# EAGLE design Schematic_rfclock_frontend (EAGLE 9.6.2)
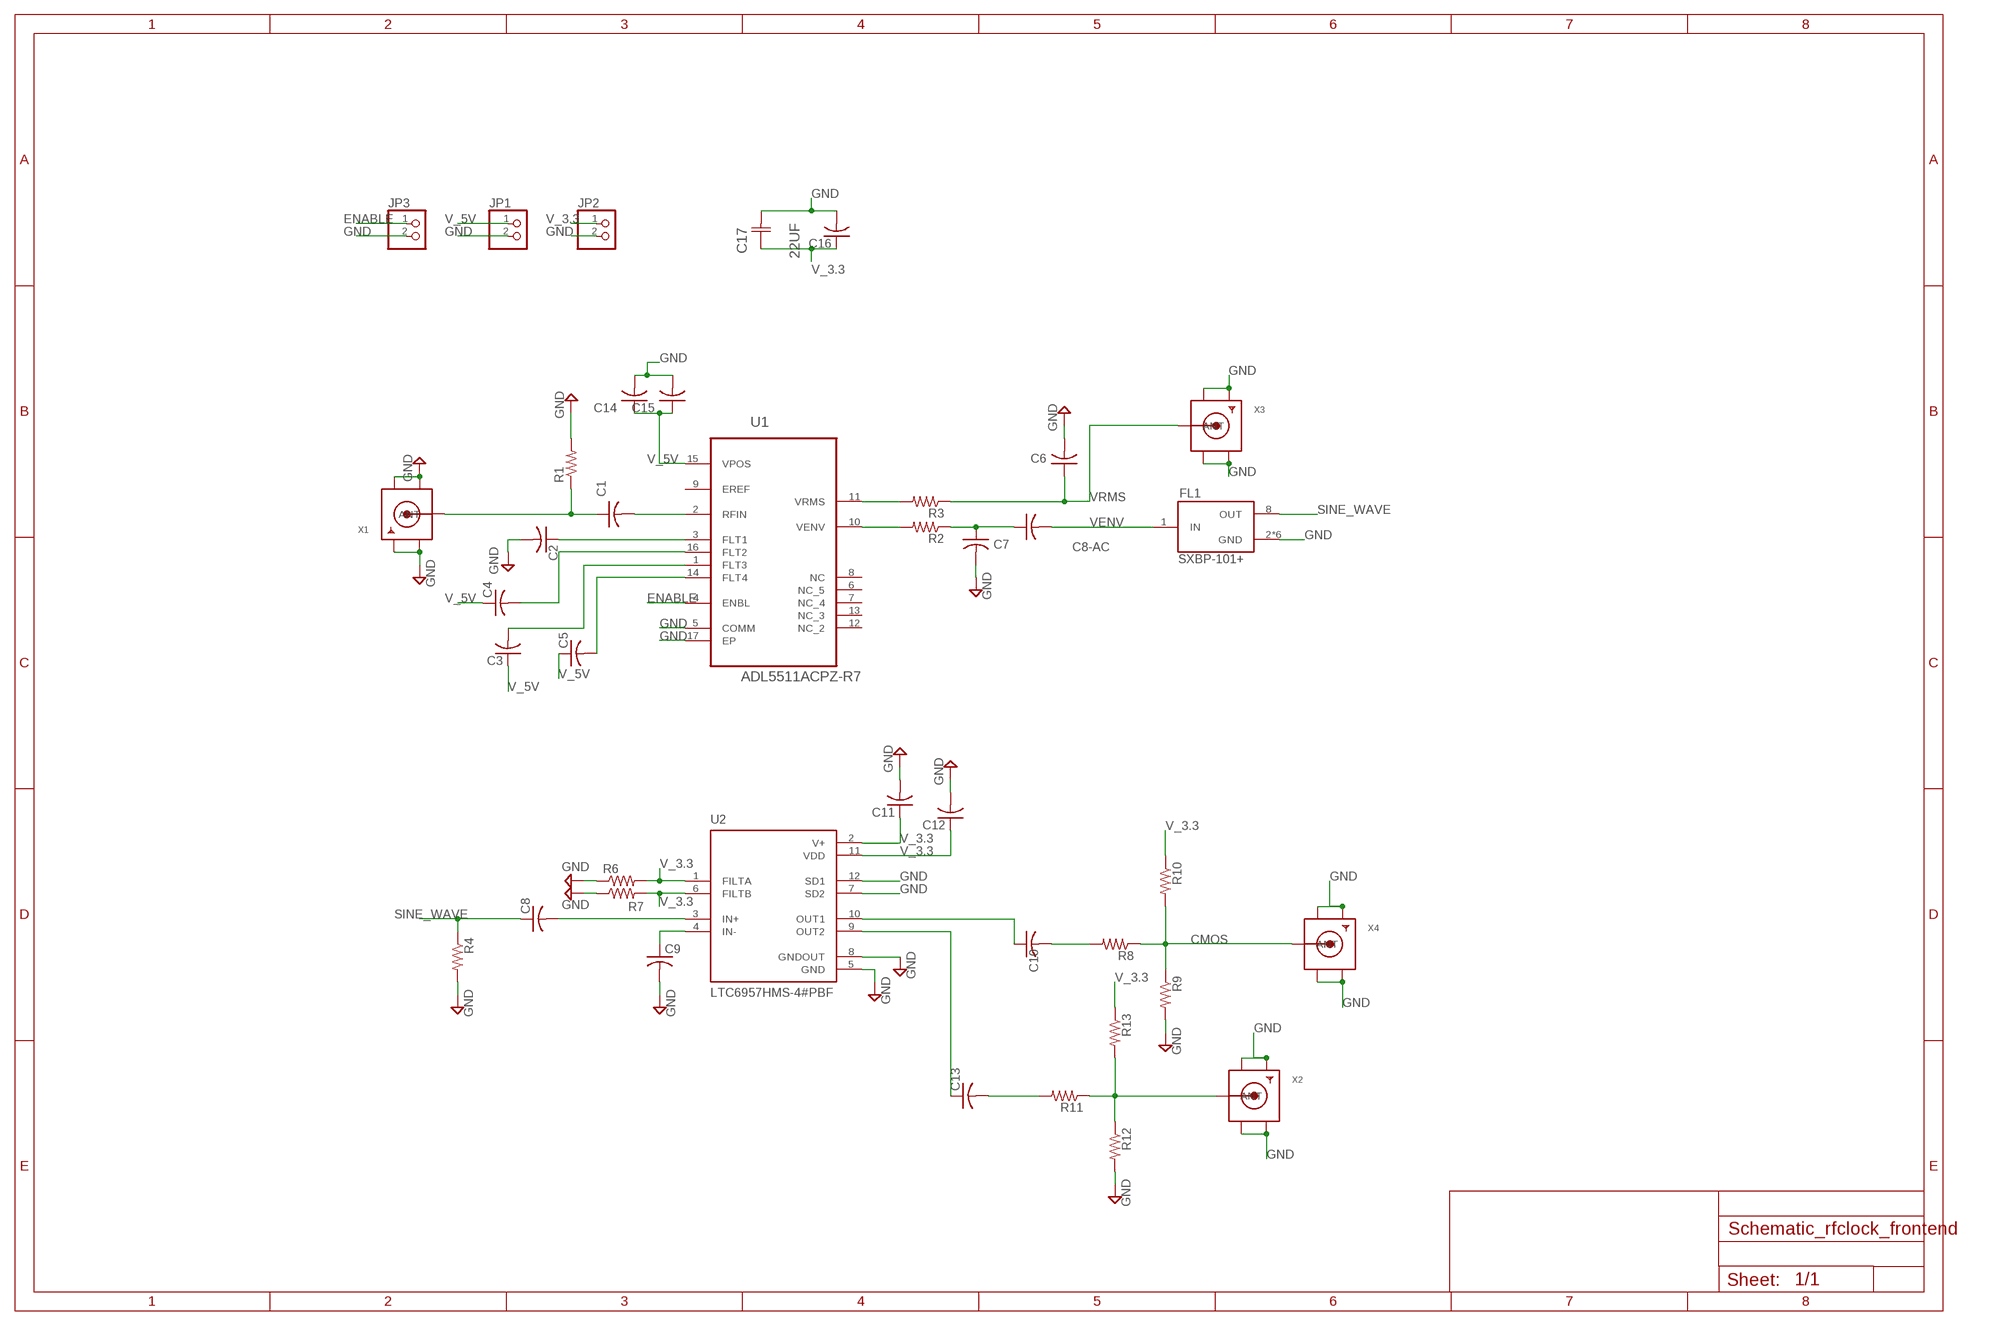
[diagram p0: schematic, sheet 1]

## Parts
C1  C-USC0402K  [C0402K]
C2  C-USC0402K  [C0402K]
C3  C-USC0402  [C0402]
C4  C-USC0402  [C0402]
C5  C-USC0402  [C0402]
C6  C-USC0402  [C0402]
C7  C-USC0402  [C0402]
C8  C-USC0603  [C0603]
C8-AC  C-USC0402K  [C0402K]
C9  C-USC0603  [C0603]
C10  C-USC0603K  [C0603K]
C11  C-USC0603K  [C0603K]
C12  C-USC0603K  [C0603K]
C13  C-USC0603K  [C0603K]
C14  C-USC0402  [C0402]
C15  C-USC0402  [C0402]
C16  C-USC0603  [C0603]
C17  22UF  TPSB226M010R0700  [CAPCP3528X210N]
FL1  SXBP-101+  [FIL_SXBP-101+]
JP1  PINHD-1X2  [1X02]
JP2  PINHD-1X2  [1X02]
JP3  PINHD-1X2  [1X02]
R1  R-US_R0402  [R0402]
R2  R-US_R0402  [R0402]
R3  R-US_R0402  [R0402]
R4  R-US_R0603  [R0603]
R6  R-US_R0603  [R0603]
R7  R-US_R0603  [R0603]
R8  R-US_R0603  [R0603]
R9  R-US_R0603  [R0603]
R10  R-US_R0603  [R0603]
R11  R-US_R0603  [R0603]
R12  R-US_R0603  [R0603]
R13  R-US_R0603  [R0603]
U1  ADL5511ACPZ-R7  [QFN50P300X300X80-17N]
U2  LTC6957HMS-4#PBF  [SOP65P490X110-12N]
X1  SMACONNECTOR_EDGE  [SMA_EDGELAUNCH]
X2  SMACONNECTOR_EDGE  [SMA_EDGELAUNCH]
X3  SMACONNECTOR_EDGE  [SMA_EDGELAUNCH]
X4  SMACONNECTOR_EDGE  [SMA_EDGELAUNCH]

## Nets
CMOS: R8.1 R9.1 R10.2 X4.P(ANT)
ENABLE: JP3.1 U1.4(ENBL)
GND: C2.2 C6.2 C7.2 C9.2 C11.2 C12.2 C14.2 C15.2 C16.2 C17.2(C2) FL1.2(GND) FL1.3(GND) FL1.4(GND) FL1.5(GND) FL1.6(GND) FL1.7(GND) JP1.2 JP2.2 JP3.2 R1.2 R4.2 R6.1 R7.1 R9.2 R12.2 U1.5(COMM) U1.17(EP) U2.5(GND) U2.7(SD2) U2.8(GNDOUT) U2.12(SD1) X1.GND@1(GND4) X1.GND@2(GND3) X1.GND@3(GND2) X1.GND@4(GND1) X2.GND@1(GND4) X2.GND@2(GND3) X2.GND@3(GND2) X2.GND@4(GND1) X3.GND@1(GND4) X3.GND@2(GND3) X3.GND@3(GND2) X3.GND@4(GND1) X4.GND@1(GND4) X4.GND@2(GND3) X4.GND@3(GND2) X4.GND@4(GND1)
N$1: C1.2 U1.2(RFIN)
N$2: C2.1 U1.3(FLT1)
N$3: C1.1 R1.1 X1.P(ANT)
N$4: C3.2 U1.1(FLT3)
N$5: C5.2 U1.14(FLT4)
N$6: C4.2 U1.16(FLT2)
N$7: R3.2 U1.11(VRMS)
N$8: R2.2 U1.10(VENV)
N$9: C7.1 C8-AC.1 R2.1
N$10: C9.1 U2.4(IN-)
N$11: C8.2 U2.3(IN+)
N$12: C10.1 U2.10(OUT1)
N$13: C10.2 R8.2
N$14: C13.1 U2.9(OUT2)
N$15: C13.2 R11.2
N$16: R11.1 R12.1 R13.2 X2.P(ANT)
SINE_WAVE: C8.1 FL1.8(OUT) R4.1
V_3.3: C11.1 C12.1 C16.1 C17.1(C1) JP2.1 R6.2 R7.2 R10.1 R13.1 U2.1(FILTA) U2.2(V+) U2.6(FILTB) U2.11(VDD)
V_5V: C3.1 C4.1 C5.1 C14.1 C15.1 JP1.1 U1.15(VPOS)
VENV: C8-AC.2 FL1.1(IN)
VRMS: C6.1 R3.1 X3.P(ANT)
Unconnected: U1.6(NC_5) U1.7(NC_4) U1.8(NC) U1.9(EREF) U1.12(NC_2) U1.13(NC_3)

## Library data of the parts
C1-C8 C8-AC C9-C16 = rcl:C-US: CAPACITOR, American symbol; SPICEPREFIX: C
C17 = AVX_By_element14_Batch_1:TPSB226M010R0700: Tantalum Capacitor , 1210; CAPACITANCETOLERANCE: ±20%; MPN: TPSB226M010R0700; OC_FARNELL: 9862439; OC_NEWARK: 36K3657; SUPPLIER: AVX; VOLTAGERATING: 10V
FL1 = SXBP-101_:SXBP-101+: RF Bandpass Filter, 50ohm, 94-108MHz; AVAILABILITY: Unavailable; DESCRIPTION: RF Bandpass Filter, 50ohm, 94-108MHz; MF: Mini-Circuits; MP: SXBP-101+; PACKAGE: None; PRICE: None
JP1-JP3 = pinhead:PINHD-1X2: PIN HEADER
R1-R4 R6-R13 = rcl:R-US_: RESISTOR, American symbol; SPICEPREFIX: R
U1 = ADL5511ACPZ-R7:ADL5511ACPZ-R7: DC to 6 GHz Envelope and TruPwr RMS Detector; AVAILABILITY: Unavailable; DESCRIPTION: RF Detector IC CDMA, CDMA2000, LTE, WiMAX 0Hz ~ 6GHz -28dBm ~ 17dBm 16-WFQFN Exposed Pad, CSP; MF: Analog Devices; MP: ADL5511ACPZ-R7; PACKAGE: LFCSP -16 Analog Devices; PRICE: None
U2 = LTC6957HMS-4_PBF:LTC6957HMS-4#PBF: Low Phase Noise, Dual Output Buffer/Driver/Logic Converter; AVAILABILITY: Unavailable; DESCRIPTION: Low Phase Noise, Dual Output Buffer/Driver/Logic Converter; MF: Analog Devices; MP: LTC6957HMS-4#PBF; PACKAGE: MSOP-12 Analog Devices; PRICE: None
X1-X4 = adafruit:SMACONNECTOR: SMA Connector 90° DIP SMA Connector, 50 Ohm (4UConnector: 07259)

## Board
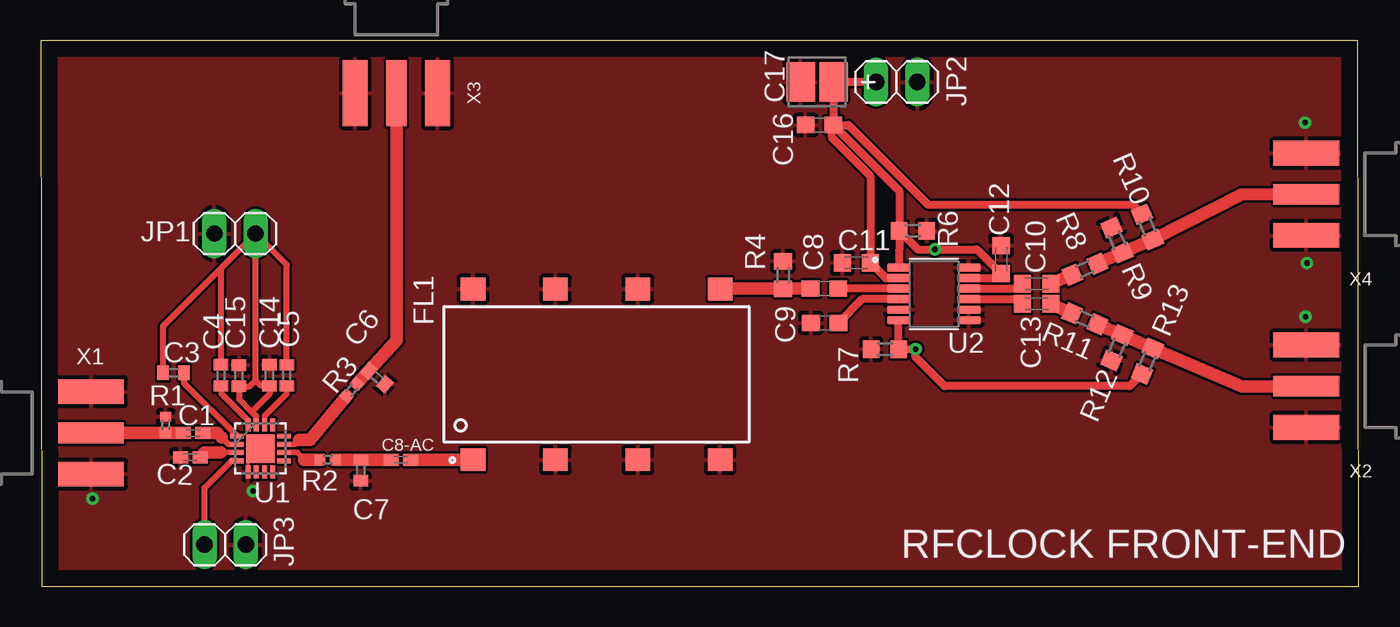
[diagram p1: board, top side]
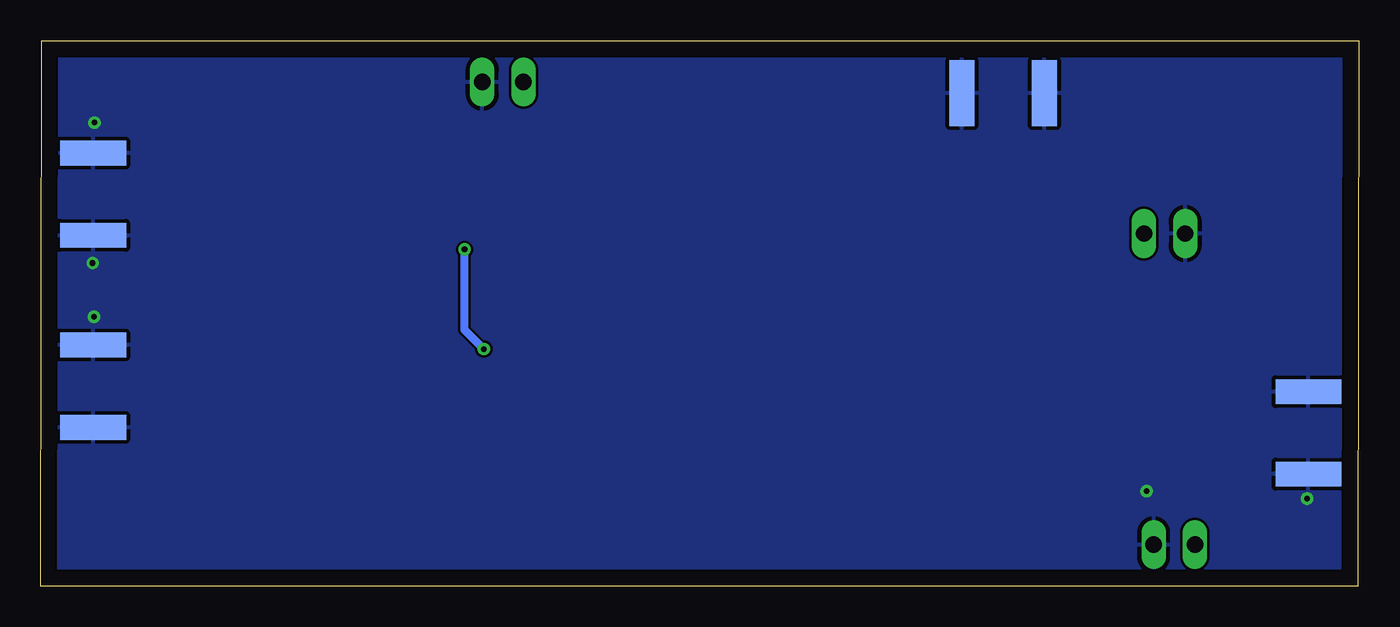
[diagram p2: board, bottom side, seen from below]

Size 81.35 x 33.68 mm. Coordinates in mm from the lower left corner, seen from the top.
Outline: 0.07,0 81.35,0 81.28,33.68 0,33.68 0.07,0
Copper layers (1*16): Top 0.035mm / dielectric 1.5mm / Bottom 0.035mm
Design rules "default *": minimum track width 6mil, minimum drill 0.35mm, track to track 6mil, track to pad 6mil, pad to pad 6mil, via to via 6mil, smd to smd 6mil, copper to edge 40mil, drill to drill 6mil, minimum pad ring 10mil, minimum via ring 8mil, stop-mask expansion 4mil, vias tented up to drill 0mil, thermal gap 10mil

### Footprints (pad centres in the part's own frame; a part is rotated, then mirrored left to right if it is on the bottom)
C0402K = smd 0.925 x 0.74: 1 -0.6,0; 2 0.6,0
C0402 = smd 0.7 x 0.9: 1 -0.65,0; 2 0.65,0
C0603 = smd 1.1 x 1: 1 -0.85,0; 2 0.85,0
C0603K = smd 1.05 x 1.08: 1 -0.875,0; 2 0.875,0
CAPCP3528X210N = smd 1.753 x 2.413: 1 -1.016,0; 2 1.016,0
FIL_SXBP-101+ = smd 1.4 x 1.52: 1 -5.27,7.62; 2 5.27,7.62; 3 -5.27,2.54; 4 5.27,2.54; 5 -5.27,-2.54; 6 5.27,-2.54; 7 -5.27,-7.62; 8 5.27,-7.62
1X02 = drill 1.016 long: 1 -1.27,0; 2 1.27,0
R0402 = smd 0.6 x 0.7: 1 -0.5,0; 2 0.5,0
R0603 = smd 1 x 1.1: 1 -0.85,0; 2 0.85,0
QFN50P300X300X80-17N = smd 0.813 x 0.305: 1 -1.448,0.762; 2 -1.448,0.254; 3 -1.448,-0.254; 4 -1.448,-0.762; 9 1.448,-0.762; 10 1.448,-0.254; 11 1.448,0.254; 12 1.448,0.762 | smd 0.305 x 0.813: 5 -0.762,-1.448; 6 -0.254,-1.448; 7 0.254,-1.448; 8 0.762,-1.448; 13 0.762,1.448; 14 0.254,1.448; 15 -0.254,1.448; 16 -0.762,1.448 | smd 1.753 x 1.753: 17 0,0
SOP65P490X110-12N = smd 1.45 x 0.48: 1 -2.16,1.625; 2 -2.16,0.975; 3 -2.16,0.325; 4 -2.16,-0.325; 5 -2.16,-0.975; 6 -2.16,-1.625; 7 2.16,-1.625; 8 2.16,-0.975; 9 2.16,-0.325; 10 2.16,0.325; 11 2.16,0.975; 12 2.16,1.625
SMA_EDGELAUNCH = smd 4.064 x 1.524: GND@1 2.032,-2.54; GND@2 2.032,2.54 | smd 4.064 x 1.524 bottom: GND@3 2.032,2.54; GND@4 2.032,-2.54 | smd 4.064 x 1.27: P 2.032,0

### Placement (x,y rotation side)
C1  9.42,9.45 0 top
C2  9.25,7.95 180 top
C3  8.21,13.18 0 top
C4  11.14,13.01 270 top
C5  15.19,13.01 270 top
C6  20.76,12.88 320.2 top
C7  19.76,7.16 270 top
C8  48.36,18.37 0 top
C8-AC  22.24,7.81 0 top
C9  48.38,16.25 180 top
C10  61.46,18.67 0 top
C11  50.34,19.96 180 top
C12  59.26,20.16 90 top
C13  61.46,17.43 0 top
C14  14.13,13.01 90 top
C15  12.24,12.99 90 top
C16  48.06,28.47 180 top
C17  47.91,31.12 180 top
FL1  34.31,13.08 90 top
JP1  12,21.77 180 top
JP2  52.82,31.12 0 top
JP3  11.39,2.56 0 top
R1  7.73,9.96 90 top
R2  17.72,7.81 180 top
R3  19.21,12.12 230.2 top
R4  45.81,19.21 90 top
R6  53.83,21.93 180 top
R7  52.1,14.63 0 top
R8  64.43,19.56 203.4 top
R9  66.42,21.36 113.4 top
R10  68.3,22.17 293.4 top
R11  64.43,16.5 156.6 top
R12  66.42,14.72 246.6 top
R13  68.3,13.89 66.6 top
U1  13.57,8.5 0 top
U2  55.12,18.04 0 top
X1  1.08,9.46 0 top
X2  80.14,12.34 180 top
X3  21.96,32.47 270 top
X4  80.13,24.2 180 top

### Tracks (layer width: path | path; a pad name or v marks a point on that pad's centre or on a via)
CMOS
  Top 0.762: R8.1 R9.1 R10.2 74.07,24.16 X4.P
ENABLE
  Top 0.381: U1.4 11.78,7.74 10.12,6.08 JP3.1
GND  (via drill 0.35)
  Top 0.152: U1.5 12.81,7.74 U1.17
  other vias: 13.1,5.87 3.21,5.4 78.02,28.62 78.13,19.95 78.06,16.62
  pour Top: -0.07,33.78 -0.07,0.14 0.07,0 81.5,0 81.57,0.07 81.57,33.78 81.5,33.85 -0.07,33.85
  pour Bottom: -0.03,33.68 -0.03,-0.3 81.14,-0.3 81.44,0 81.44,33.78 81.54,33.88 -0.03,33.88 -0.13,33.78
N$1
  Top 0.33: 11.18,9.17 11.59,8.75 U1.2
  Top 0.762: C1.2 10.89,9.46 11.18,9.17
N$2
  Top 0.33: U1.3 11.57,8.24 11.12,8.24
  Top 0.762: C2.1 10.14,8.24 11.12,8.24
N$3
  Top 0.762: C1.1 8.81,9.46 R1.1 X1.P
N$4
  Top 0.381: U1.1 8.86,12.52 C3.2
N$5
  Top 0.33: U1.14 13.82,10.49 15.19,11.86 C5.2 | C5.2
N$6
  Top 0.33: U1.16 12.81,10.23 11.14,11.89 C4.2
N$7
  Top 0.33: U1.11 15.67,8.75 15.96,9.04
  Top 0.762: R3.2 16.64,9.04 15.96,9.04
N$8
  Top 0.33: U1.10 15.83,8.24 16.26,7.81
  Top 0.762: 16.26,7.81 R2.2
N$9
  Top 0.762: R2.1 C7.1 21.58,7.81 C8-AC.1
N$10
  Top 0.483: U2.4 50.69,17.72 C9.1
N$11
  Top 0.483: U2.3 C8.2
  Top 0.762: C8.2
N$12
  Top 0.483: U2.10 60.29,18.37 C10.1
N$13
  Top 0.483: C10.2
  Top 0.762: R8.2 C10.2
N$14
  Top 0.483: U2.9 60.3,17.72 C13.1
N$15
  Top 0.762: C13.2 R11.2
N$16
  Top 0.762: R11.1 R12.1 R13.2 74.13,12.32 X2.P
SINE_WAVE
  Top 0.762: FL1.8 41.94,18.36 R4.1 C8.1
V_3.3  (via drill 0.35)
  Top 0.483: R7.2 52.95,16.4 U2.6 | U2.11 58.99,19.02 C12.1
  Top 0.508: JP2.1 C17.1 C16.1 | R6.2 U2.1 | U2.2 52.16,19.02 C11.1 51.2,19.98 51.2,25.31 48.83,27.68 48.83,28.39 C16.1 | C16.1 52.98,24.4 R6.2 | R7.2 53.99,14.63 | 53.99,14.63 v54,14.63 | R6.2 54.13,20.79 v55.19,20.79 57.77,20.79 C12.1 | C16.1 49.83,28.47 54.74,23.56 67.36,23.56 R10.1 | R13.1 67.21,12.36 55.78,12.36 53.99,14.15 53.99,14.63
  Bottom 0.508: v54,14.63 55.19,15.82 v55.19,20.79
V_5V
  Top 0.381: U1.15 13.31,10.48 13.22,10.57 13.03,10.77 | 13.03,10.77 12.24,11.55 C15.1 12.9,12.34 13.27,12.71 | 13.03,10.77 14.13,11.87 C14.1 13.62,12.36 13.27,12.71 | C3.1 7.56,16.06 11.14,19.64 | C4.1 11.14,19.63 11.14,19.64 | C5.1 15.19,19.84 JP1.1 | 13.27,12.71 JP1.1 | JP1.1 11.14,19.64
VENV
  Top 0.762: C8-AC.2 FL1.1
VRMS
  Top 0.762: X3.P 21.98,26.8 21.96,15.16 C6.1 R3.1

### Text on the board
tNames: RFCLOCK FRONT-END